# EAGLE design Cellphone-Detector-LM358-Flip-Flop (EAGLE 7.2.0)
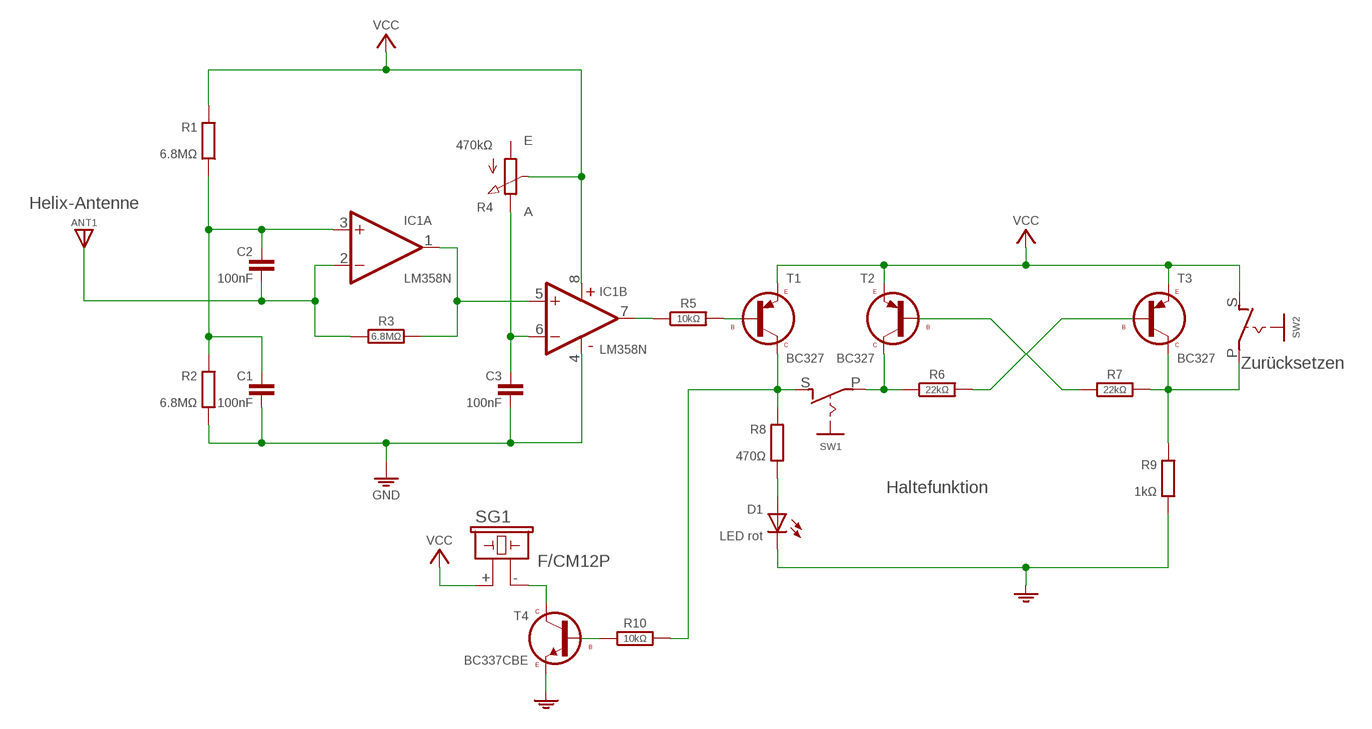
[diagram p0: schematic, sheet 1]

## Parts
ANT1  ANT  [SPAD]
C1  100nF  C025-025X060  [C050-025X060]
C2  100nF  C025-024X044  [C025-024X044]
C3  100nF  C025-024X044  [C025-024X044]
D1  LED rot  LED-3MM/V  [LED_3MM/V]
IC1  LM358N  [DIL08]
R1  6.8MΩ  R0204/2  [0204/2]
R2  6.8MΩ  R0204/2V  [0204/2V]
R3  6.8MΩ  R-H0202/2V  [0202/2V]
R4  470kΩ  POT-3P  [CONN-3P]
R5  10kΩ  R-H0204/10  [0204/10]
R6  22kΩ  R-H0204/10  [0204/10]
R7  22kΩ  R-H0204/10  [0204/10]
R8  470Ω  R0204/10-V  [0204/10-V]
R9  1kΩ  R0204/10  [0204/10]
R10  10kΩ  R-H0204/10  [0204/10]
S1  VCC_GNDR  [SPAD+-]
SG1  F/CM12P  [F/CM12P]
SW1  SW1  SL-SW-1P-1T  [SLSW-1P1T]
SW2  PB-1P-1T-2P  [SLSW-1P1T]
T1  BC327  [TO92]
T2  BC327  [TO92]
T3  BC327  [TO92]
T4  BC337CBE  [TO92-CBE]

## Nets
ANT: ANT1.1 C2.2 IC1.2(A:-IN) R3.1
GND: C1.2 C3.2 D1.K(C) IC1.4(P:V-) R2.2 R9.2 S1.1 T4.3(E)
N$1: C3.1 IC1.6(B:-IN) R4.3(E)
N$2: SG1.- T4.1(C)
N$3: IC1.7(B:OUT) R5.1
N$4: C1.1 C2.1 IC1.3(A:+IN) R1.2 R2.1
N$5: R7.2 R9.1 SW2.P T3.1(C)
N$6: R6.1 SW1.P T2.1(C)
N$7: R6.2 T3.2(B)
N$8: R10.1 T4.2(B)
N$9: R7.1 T2.2(B)
N$12: D1.A R8.2
N$13: R8.1 R10.2 SW1.S T1.1(C)
N$14: R5.2 T1.2(B)
SIG: IC1.1(A:OUT) IC1.5(B:+IN) R3.2
VCC: IC1.8(P:V+) R1.1 R4.2(S) S1.2 SG1.+ SW2.S T1.3(E) T2.3(E) T3.3(E)
Unconnected: R4.1(A)

## Notes on the sheet
- Helix-Antenne
- Zurücksetzen
- Haltefunktion

## Library data of the parts
ANT1 = pad:ANT
C1-C3 = c:C: CAPACITOR, European symbol
D1 = d:LED
IC1 = ic:LM358: OP AMP also LM158; LM258; LM2904 Source: http://cache.national.com/ds/LM/LM158.pdf
R1 R2 R8 R9 = r:R: RESISTOR, European symbol
R3 R5-R7 R10 = r:R-H
R4 = r:POT
S1 = pad:VCC_GND
SG1 = buzzer:F/CM12P: BUZZER Source: Buerklin; OC_FARNELL: unknown; OC_NEWARK: unknown
SW1 = sw:SL-SW-1P-1T
SW2 = sw:PB-1P-1T
T1-T3 = t:BC327
T4 = t:BC337

## Net classes
0 default: clearance 0.406 mm

## Board
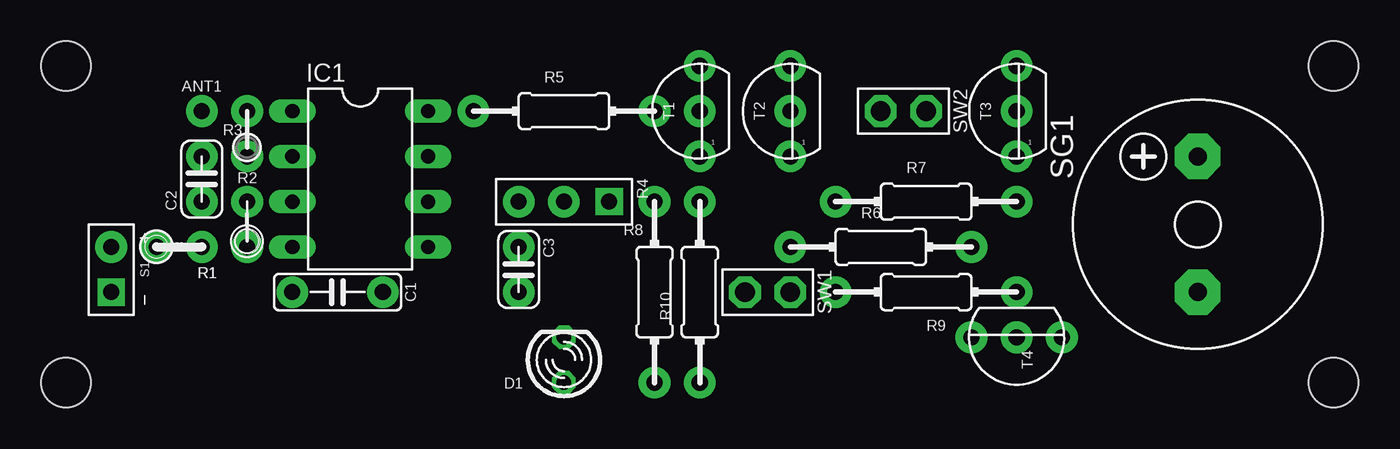
[diagram p1: board, top side]
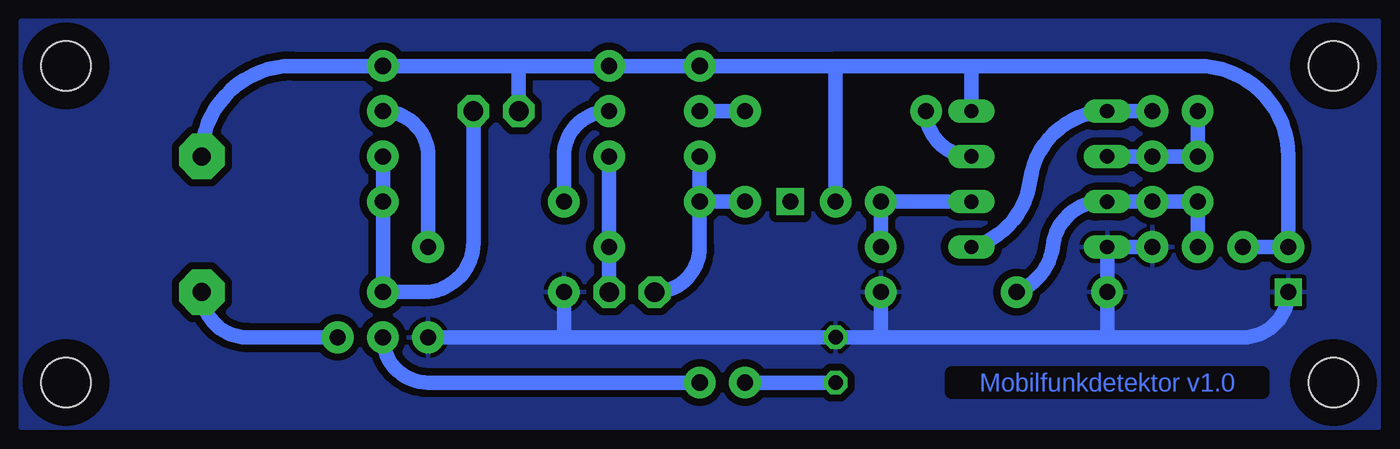
[diagram p2: board, bottom side, seen from below]

No outline drawn. Coordinates in mm, seen from the top.
Copper layers (1*16): Top 0.035mm / dielectric 1.5mm / Bottom 0.035mm
Design rules "default": minimum track width 10mil, minimum drill 24mil, track to track 8mil, track to pad 8mil, pad to pad 8mil, via to via 8mil, smd to smd 8mil, copper to edge 40mil, drill to drill 8mil, minimum pad ring 10mil, minimum via ring 8mil, stop-mask expansion 4mil, vias tented up to drill 0mil, thermal gap 10mil
Holes 2.8 mm at 2.54,20.32 2.54,2.54 73.66,20.32 73.66,2.54

### Footprints (pad centres in the part's own frame; a part is rotated, then mirrored left to right if it is on the bottom)
SPAD = drill 0.9 pad 1.778: 1 0,0
C050-025X060 = drill 0.9 pad 1.778: 1 0,2.54; 2 0,-2.54
C025-024X044 = drill 0.9 pad 1.778: 1 -1.27,0; 2 1.27,0
LED_3MM/V = drill 0.813 pad 1.27 octagon: A 0,1.27; K 0,-1.27
DIL08 = drill 0.8 pad 1.27 long: 1 -3.81,3.81; 2 -3.81,1.27; 3 -3.81,-1.27; 4 -3.81,-3.81; 5 3.81,-3.81; 6 3.81,-1.27; 7 3.81,1.27; 8 3.81,3.81
0204/2 = drill 0.9 pad 1.778: 1 1.27,0; 2 -1.27,0
0204/2V = drill 0.9 pad 1.778: 1 0,1.27; 2 0,-1.27
0202/2V = drill 0.9 pad 1.778: 1 0,-1.27; 2 0,1.27
CONN-3P = drill 0.9 pad 1.524 square: 1 0,2.54 | drill 0.9 pad 1.778: 2 0,0; 3 0,-2.54
0204/10 = drill 0.9 pad 1.778: 1 -5.08,0; 2 5.08,0
0204/10-V = drill 0.9 pad 1.778: 1 0,5.08; 2 0,-5.08
SPAD+- = drill 0.9 pad 1.524 square: 1 0,-1.27 | drill 0.9 pad 1.778: 2 0,1.27
F/CM12P = drill 1.016 pad 2.54 octagon: + 3.81,0; - -3.81,0
SLSW-1P1T = drill 1.1 pad 1.778 octagon: P 0,0; S 0,-2.54
TO92 = drill 0.9 pad 1.778: 1 0,2.54; 2 0,0; 3 0,-2.54
TO92-CBE = drill 0.9 pad 1.778: 1 0,2.54; 2 0,0; 3 0,-2.54

### Placement (x,y rotation side)
ANT1  10.16,17.78 270 top
C1  17.78,7.62 270 top
C2  10.16,13.97 90 top
C3  27.94,8.89 270 top
D1  30.48,3.81 180 top
IC1  19.05,13.97 0 top
R1  8.89,10.16 180 top
R2  12.7,11.43 0 top
R3  12.7,16.51 0 top
R4  30.48,12.7 270 top
R5  30.48,17.78 0 top
R6  48.26,10.16 0 top
R7  50.8,12.7 0 top
R8  35.56,7.62 0 top
R9  50.8,7.62 180 top
R10  38.1,7.62 90 top
S1  5.08,8.89 0 top
SG1  66.04,11.43 90 top
SW1  43.18,7.62 270 top
SW2  50.8,17.78 270 top
T1  38.1,17.78 180 top
T2  43.18,17.78 180 top
T3  55.88,17.78 180 top
T4  55.88,5.08 270 top

### Tracks (layer width: path | path; a pad name or v marks a point on that pad's centre or on a via)
ANT
  Bottom 0.813: IC1.2 R3.1 C2.2 ANT1.1
GND
  Bottom 0.813: R2.2 IC1.4 C1.2 15.24,5.08 | 15.24,5.08 27.94,5.08 | 27.94,5.08 C3.2 | 27.94,5.08 D1.K 45.72,5.08 | T4.3 45.72,5.08 | 45.72,5.08 R9.2 | 15.24,5.08 7.62,5.08 arc-90 S1.1
  pour Bottom: 0,22.86 76.2,22.86 76.2,0 0,0
N$1
  Bottom 0.813: C3.1 R4.3 IC1.6
N$2
  Bottom 0.813: T4.1 63.5,5.08 arc90 SG1.-
N$3
  Bottom 0.813: IC1.7 arc90 R5.1
N$4
  Bottom 0.813: R1.2 C2.1 R2.1 IC1.3 arc-90 18.29,10.16 arc60 C1.1
N$5
  Bottom 0.813: T3.1 R7.2 R9.1 53.59,7.62 arc-90 50.8,10.41 SW2.P
N$6
  Bottom 0.813: T2.1 SW1.P R6.1
N$7
  Bottom 0.813: R6.2 53.34,15.24 arc-90 T3.2
N$8
  Bottom 0.813: R10.1 53.34,2.54 arc90 T4.2
N$9
  Bottom 0.813: T2.2 arc-90 45.72,15.24 R7.1
N$11
  Bottom 0.305: 1.64,19.42 3.44,21.22
N$12
  Bottom 0.813: R8.2 D1.A
N$13
  Bottom 0.813: R8.1 R10.2 | R10.2 T1.1 | SW1.S arc-90 38.1,10.16 R10.2
N$14
  Bottom 0.813: T1.2 R5.2
N$15
  Bottom 0.305: 1.64,21.22 3.44,19.42
N$16
  Bottom 0.305: 1.64,1.64 3.44,3.44
N$17
  Bottom 0.305: 1.64,3.44 3.44,1.64
N$18
  Bottom 0.305: 72.76,19.42 74.56,21.22
N$19
  Bottom 0.305: 72.76,21.22 74.56,19.42
N$20
  Bottom 0.305: 72.76,1.64 74.56,3.44
N$21
  Bottom 0.305: 72.76,3.44 74.56,1.64
SIG
  Bottom 0.813: R3.2 IC1.1 arc-80 19.56,13.97 arc70 IC1.5
VCC
  Bottom 0.813: IC1.8 22.86,20.32 | 22.86,20.32 30.48,20.32 | 30.48,20.32 R4.2 | 30.48,20.32 T1.3 T2.3 48.26,20.32 | SW2.S 48.26,20.32 | 48.26,20.32 T3.3 60.96,20.32 arc-90 SG1.+ | R1.1 S1.2 5.08,15.24 arc-90 10.16,20.32 22.86,20.32

### Text on the board
Bottom: Mobilfunkdetektor v1.0